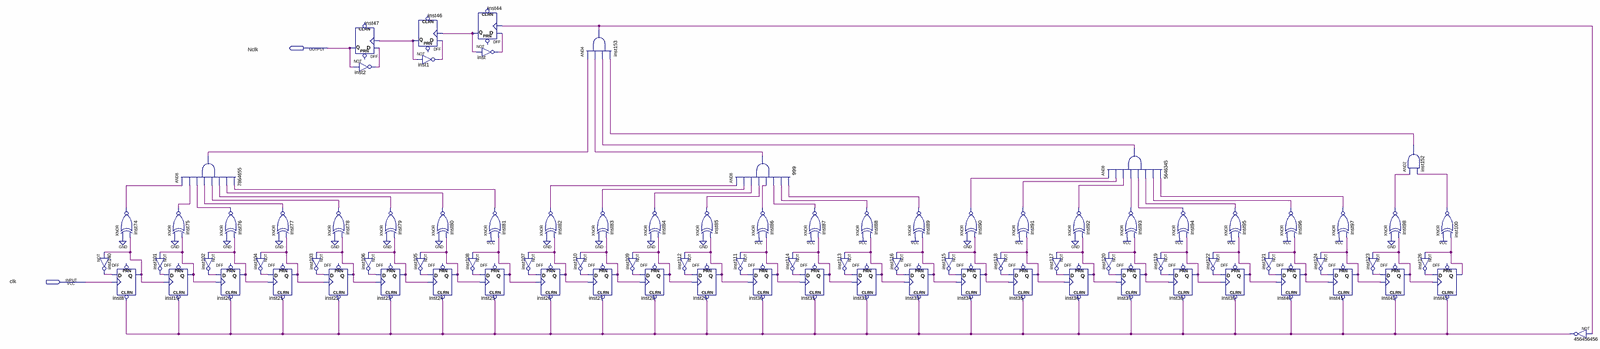
[diagram p0: schematic sheet, whole]
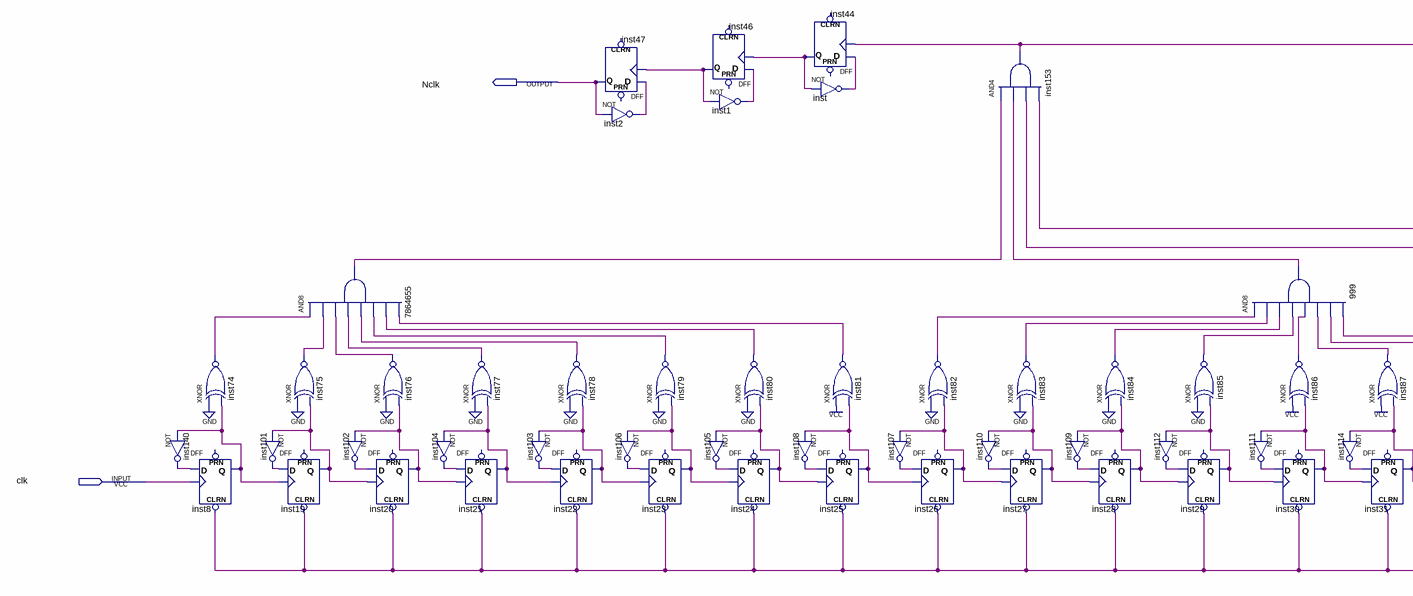
[diagram p1: schematic sheet, left part]
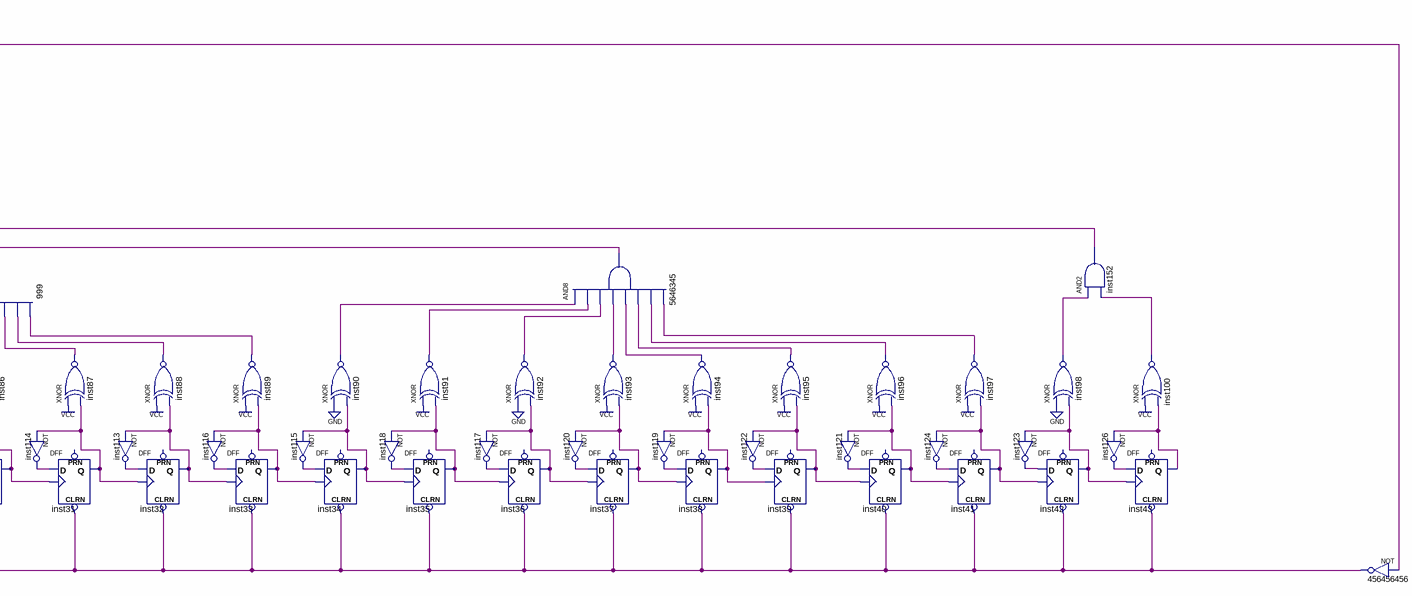
[diagram p2: schematic sheet, right part]
// Quartus schematic Timer.bdf as structural Verilog: 90 symbols, 2 pins
module Timer (
  input  clk,
  output Nclk
);

  wire inst1_out, inst2_out, inst8_q, inst19_q, inst20_q, inst21_q, inst22_q, inst23_q, inst24_q, inst25_q,
       inst26_q, inst27_q, inst28_q, inst29_q, inst30_q, inst31_q, inst32_q, inst33_q, inst34_q, inst35_q,
       inst36_q, inst37_q, inst38_q, inst39_q, inst40_q, inst41_q, inst42_q, inst43_q, inst44_q, inst46_q,
       inst74_out, inst75_out, inst76_out, inst77_out, inst78_out, inst79_out, inst80_out, inst81_out,
       inst82_out, inst83_out, inst84_out, inst85_out, inst86_out, inst87_out, inst88_out, inst89_out,
       inst90_out, inst91_out, inst92_out, inst93_out, inst94_out, inst95_out, inst96_out, inst97_out,
       inst98_out, inst100_out, inst101_out, inst102_out, inst103_out, inst104_out, inst105_out, inst106_out,
       inst107_out, inst108_out, inst109_out, inst110_out, inst111_out, inst112_out, inst113_out,
       inst114_out, inst115_out, inst116_out, inst117_out, inst118_out, inst119_out, inst120_out,
       inst121_out, inst122_out, inst123_out, inst124_out, inst126_out, inst140_out, inst152_out,
       inst153_out, inst_out, n999_out, n5646345_out, n7864655_out, n456456456_out;

  xnor inst74 (inst74_out, 1'b0, inst8_q);
  not inst140 (inst140_out, inst8_q);
  DFF inst8 (.CLRN(n456456456_out), .CLK(clk), .D(inst140_out), .Q(inst8_q));  // open: PRN
  and u_7864655 (n7864655_out, inst74_out, inst75_out, inst76_out, inst77_out, inst78_out, inst79_out, inst80_out, inst81_out);
  xnor inst75 (inst75_out, 1'b0, inst19_q);
  not inst101 (inst101_out, inst19_q);
  DFF inst19 (.CLRN(n456456456_out), .CLK(inst8_q), .D(inst101_out), .Q(inst19_q));  // open: PRN
  not inst102 (inst102_out, inst20_q);
  xnor inst76 (inst76_out, 1'b0, inst20_q);
  DFF inst20 (.CLRN(n456456456_out), .CLK(inst19_q), .D(inst102_out), .Q(inst20_q));  // open: PRN
  not inst104 (inst104_out, inst21_q);
  DFF inst21 (.CLRN(n456456456_out), .CLK(inst20_q), .D(inst104_out), .Q(inst21_q));  // open: PRN
  xnor inst77 (inst77_out, 1'b0, inst21_q);
  xnor inst78 (inst78_out, 1'b0, inst22_q);
  not inst103 (inst103_out, inst22_q);
  DFF inst22 (.CLRN(n456456456_out), .CLK(inst21_q), .D(inst103_out), .Q(inst22_q));  // open: PRN
  DFF inst47 (.CLK(inst46_q), .D(inst2_out), .Q(Nclk));  // open: CLRN, PRN
  not inst2 (inst2_out, Nclk);
  xnor inst79 (inst79_out, 1'b0, inst23_q);
  not inst106 (inst106_out, inst23_q);
  DFF inst23 (.CLRN(n456456456_out), .CLK(inst22_q), .D(inst106_out), .Q(inst23_q));  // open: PRN
  DFF inst46 (.CLK(inst44_q), .D(inst1_out), .Q(inst46_q));  // open: CLRN, PRN
  not inst1 (inst1_out, inst46_q);
  not inst105 (inst105_out, inst24_q);
  xnor inst80 (inst80_out, 1'b0, inst24_q);
  DFF inst24 (.CLRN(n456456456_out), .CLK(inst23_q), .D(inst105_out), .Q(inst24_q));  // open: PRN
  DFF inst44 (.CLK(inst153_out), .D(inst_out), .Q(inst44_q));  // open: CLRN, PRN
  not inst (inst_out, inst44_q);
  not inst108 (inst108_out, inst25_q);
  xnor inst81 (inst81_out, 1'b1, inst25_q);
  DFF inst25 (.CLRN(n456456456_out), .CLK(inst24_q), .D(inst108_out), .Q(inst25_q));  // open: PRN
  not inst107 (inst107_out, inst26_q);
  DFF inst26 (.CLRN(n456456456_out), .CLK(inst25_q), .D(inst107_out), .Q(inst26_q));  // open: PRN
  xnor inst82 (inst82_out, 1'b0, inst26_q);
  and inst153 (inst153_out, n7864655_out, n999_out, n5646345_out, inst152_out);
  xnor inst83 (inst83_out, 1'b0, inst27_q);
  not inst110 (inst110_out, inst27_q);
  DFF inst27 (.CLRN(n456456456_out), .CLK(inst26_q), .D(inst110_out), .Q(inst27_q));  // open: PRN
  not inst109 (inst109_out, inst28_q);
  xnor inst84 (inst84_out, 1'b0, inst28_q);
  DFF inst28 (.CLRN(n456456456_out), .CLK(inst27_q), .D(inst109_out), .Q(inst28_q));  // open: PRN
  not inst112 (inst112_out, inst29_q);
  xnor inst85 (inst85_out, 1'b0, inst29_q);
  DFF inst29 (.CLRN(n456456456_out), .CLK(inst28_q), .D(inst112_out), .Q(inst29_q));  // open: PRN
  and u_999 (n999_out, inst82_out, inst83_out, inst84_out, inst85_out, inst86_out, inst87_out, inst88_out, inst89_out);
  not inst111 (inst111_out, inst30_q);
  xnor inst86 (inst86_out, 1'b1, inst30_q);
  DFF inst30 (.CLRN(n456456456_out), .CLK(inst29_q), .D(inst111_out), .Q(inst30_q));  // open: PRN
  xnor inst87 (inst87_out, 1'b1, inst31_q);
  not inst114 (inst114_out, inst31_q);
  DFF inst31 (.CLRN(n456456456_out), .CLK(inst30_q), .D(inst114_out), .Q(inst31_q));  // open: PRN
  xnor inst88 (inst88_out, 1'b1, inst32_q);
  not inst113 (inst113_out, inst32_q);
  DFF inst32 (.CLRN(n456456456_out), .CLK(inst31_q), .D(inst113_out), .Q(inst32_q));  // open: PRN
  not inst116 (inst116_out, inst33_q);
  xnor inst89 (inst89_out, 1'b1, inst33_q);
  DFF inst33 (.CLRN(n456456456_out), .CLK(inst32_q), .D(inst116_out), .Q(inst33_q));  // open: PRN
  not inst115 (inst115_out, inst34_q);
  xnor inst90 (inst90_out, 1'b0, inst34_q);
  DFF inst34 (.CLRN(n456456456_out), .CLK(inst33_q), .D(inst115_out), .Q(inst34_q));  // open: PRN
  xnor inst91 (inst91_out, 1'b1, inst35_q);
  not inst118 (inst118_out, inst35_q);
  DFF inst35 (.CLRN(n456456456_out), .CLK(inst34_q), .D(inst118_out), .Q(inst35_q));  // open: PRN
  xnor inst92 (inst92_out, 1'b0, inst36_q);
  not inst117 (inst117_out, inst36_q);
  DFF inst36 (.CLRN(n456456456_out), .CLK(inst35_q), .D(inst117_out), .Q(inst36_q));  // open: PRN
  and u_5646345 (n5646345_out, inst90_out, inst91_out, inst92_out, inst93_out, inst94_out, inst95_out, inst96_out, inst97_out);
  not inst120 (inst120_out, inst37_q);
  xnor inst93 (inst93_out, 1'b1, inst37_q);
  DFF inst37 (.CLRN(n456456456_out), .CLK(inst36_q), .D(inst120_out), .Q(inst37_q));  // open: PRN
  not inst119 (inst119_out, inst38_q);
  xnor inst94 (inst94_out, 1'b1, inst38_q);
  DFF inst38 (.CLRN(n456456456_out), .CLK(inst37_q), .D(inst119_out), .Q(inst38_q));  // open: PRN
  not inst122 (inst122_out, inst39_q);
  DFF inst39 (.CLRN(n456456456_out), .CLK(inst38_q), .D(inst122_out), .Q(inst39_q));  // open: PRN
  xnor inst95 (inst95_out, 1'b1, inst39_q);
  xnor inst96 (inst96_out, 1'b1, inst40_q);
  not inst121 (inst121_out, inst40_q);
  DFF inst40 (.CLRN(n456456456_out), .CLK(inst39_q), .D(inst121_out), .Q(inst40_q));  // open: PRN
  xnor inst97 (inst97_out, 1'b1, inst41_q);
  not inst124 (inst124_out, inst41_q);
  DFF inst41 (.CLRN(n456456456_out), .CLK(inst40_q), .D(inst124_out), .Q(inst41_q));  // open: PRN
  not inst123 (inst123_out, inst42_q);
  xnor inst98 (inst98_out, 1'b0, inst42_q);
  DFF inst42 (.CLRN(n456456456_out), .CLK(inst41_q), .D(inst123_out), .Q(inst42_q));  // open: PRN
  and inst152 (inst152_out, inst98_out, inst100_out);
  not inst126 (inst126_out, inst43_q);
  xnor inst100 (inst100_out, 1'b1, inst43_q);
  DFF inst43 (.CLRN(n456456456_out), .CLK(inst42_q), .D(inst126_out), .Q(inst43_q));  // open: PRN
  not u_456456456 (n456456456_out, inst153_out);
endmodule
